# EAGLE board agatram128 (EAGLE 7.5.0), part 1 of 2
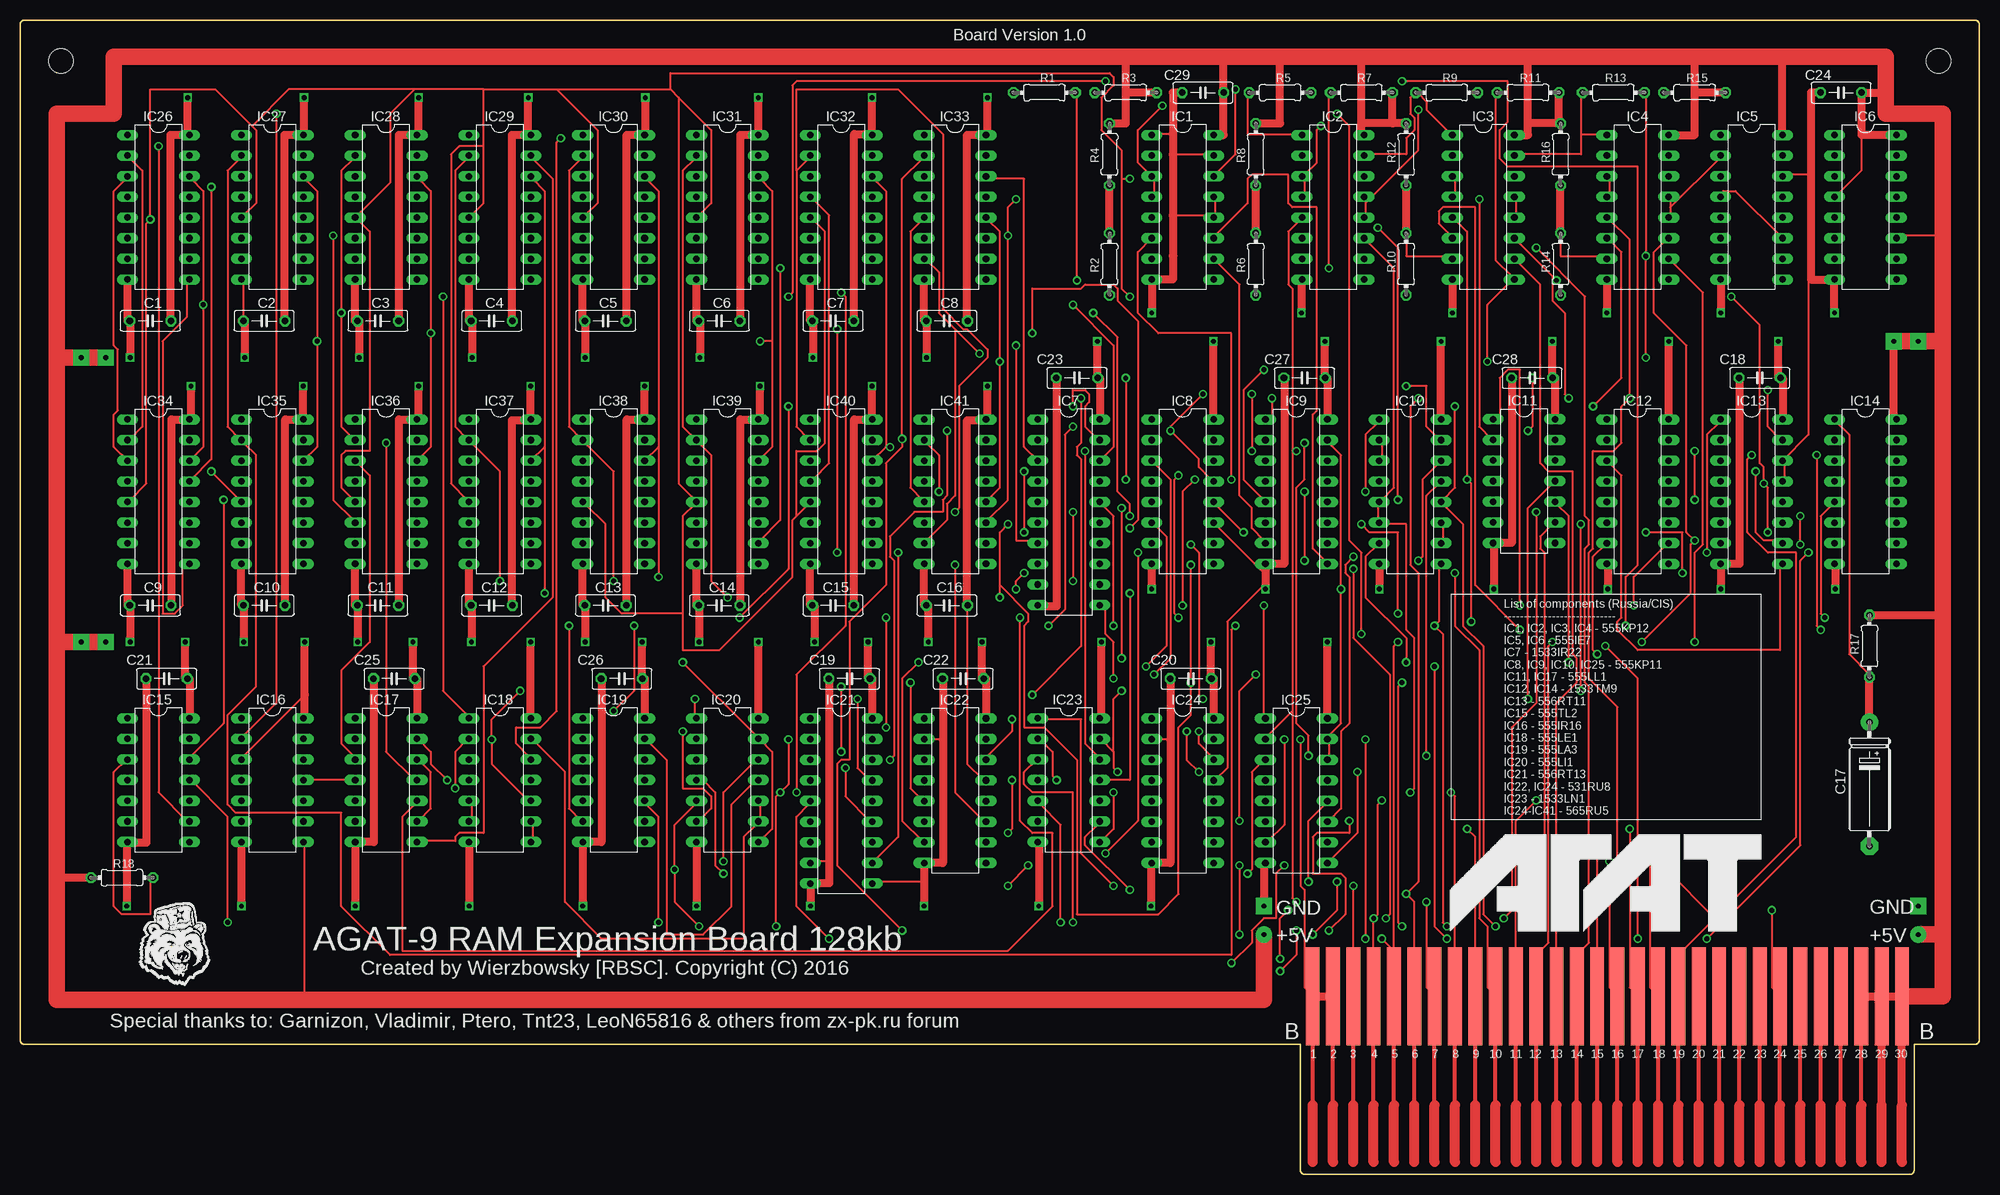
[diagram p3: board, top side]
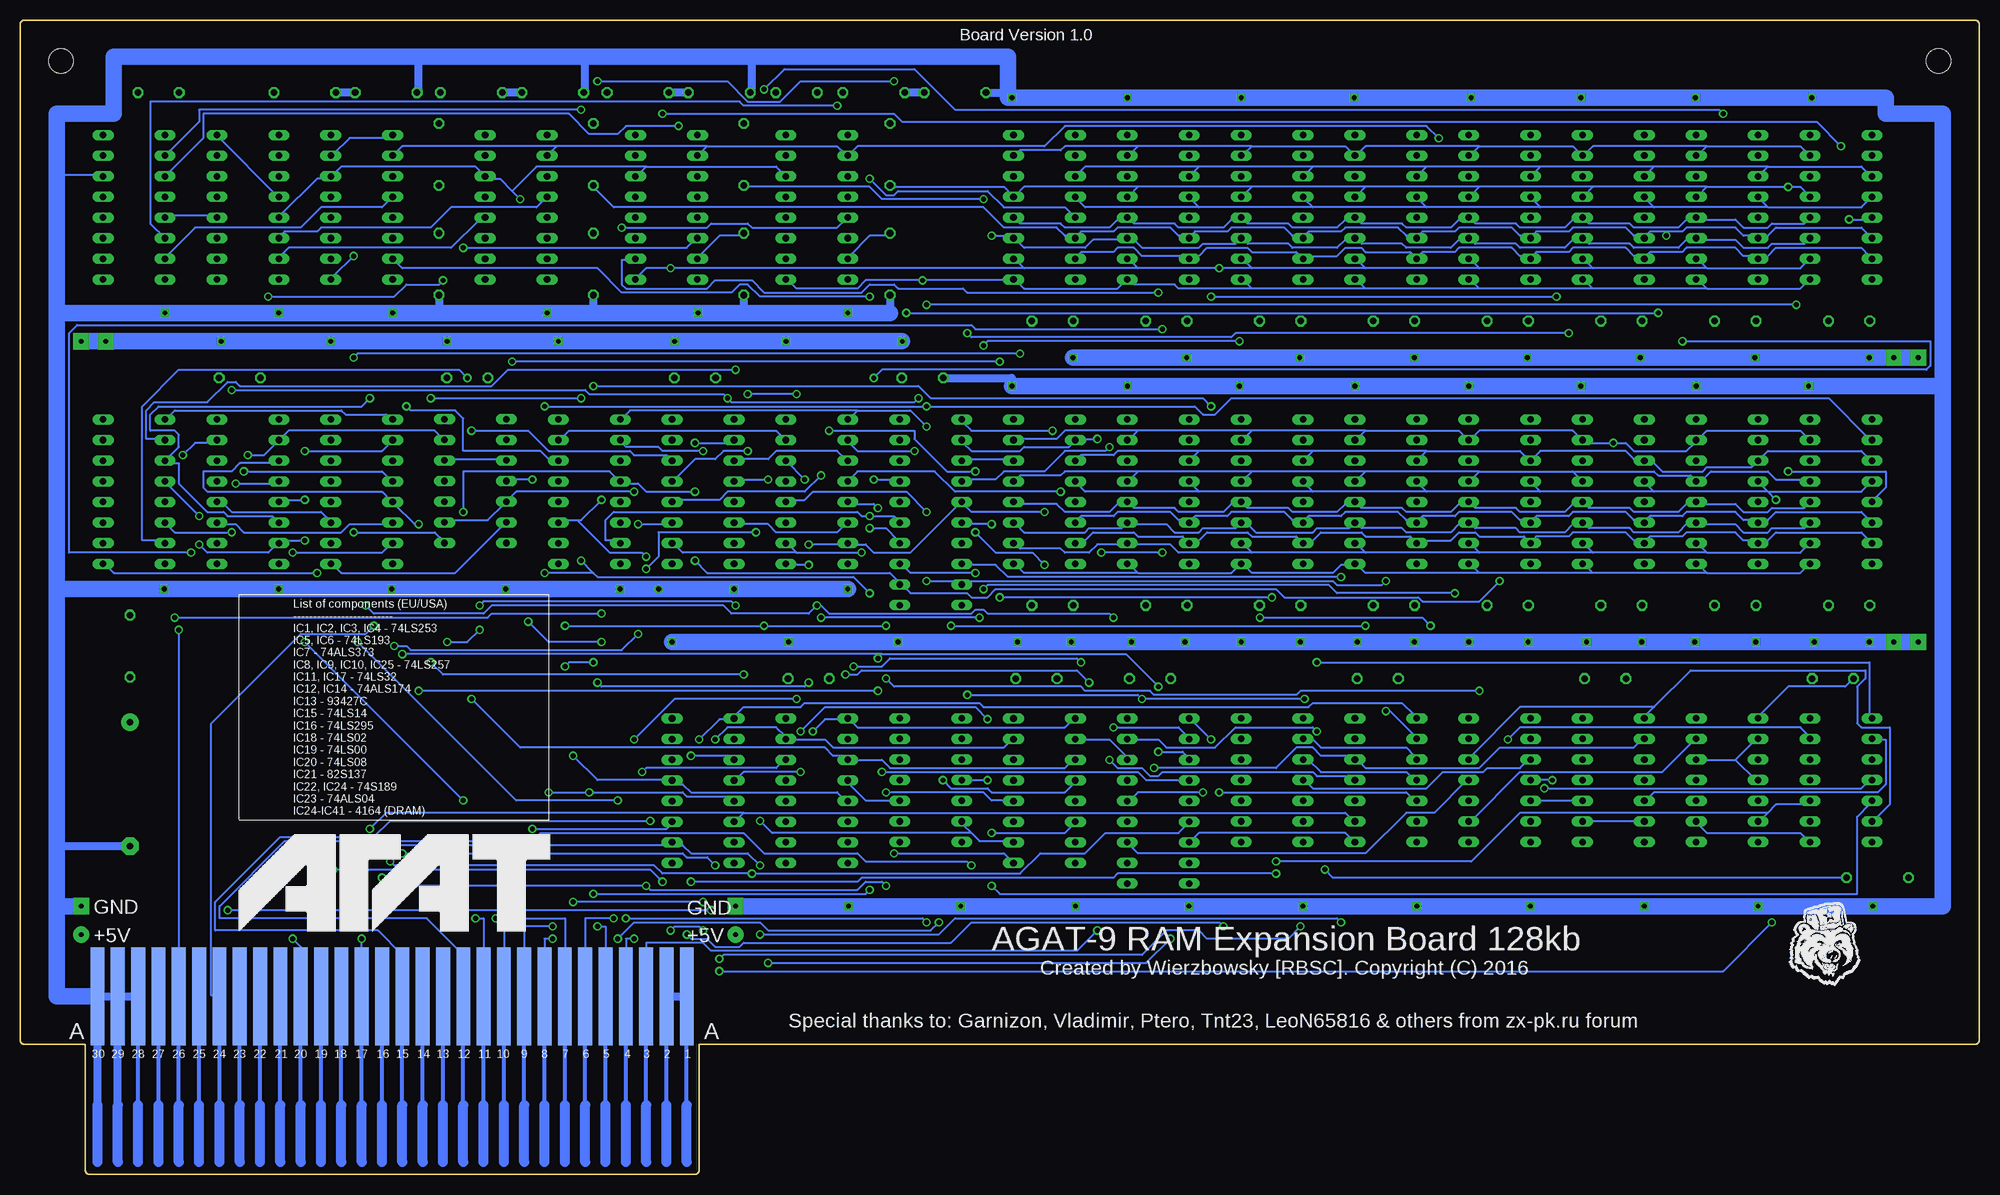
[diagram p4: board, bottom side, seen from below]

Size 241 x 142 mm. Coordinates in mm from the lower left corner, seen from the top.
Outline: 0.5,142 240.5,142 arc-90 241,141.5 241,16.5 arc-90 240.5,16 233,16 233,0.5 arc-90 232.5,0 158,0 arc-90 157.5,0.5 157.5,16 0.5,16 arc-90 0,16.5 0,141.5 arc-90 0.5,142
Copper layers (1*16): Top 0.035mm / dielectric 1.5mm / Bottom 0.035mm
Design rules "default *": minimum track width 10mil, minimum drill 24mil, track to track 8mil, track to pad 8mil, pad to pad 8mil, via to via 8mil, smd to smd 8mil, copper to edge 40mil, drill to drill 8mil, minimum pad ring 10mil, minimum via ring 8mil, stop-mask expansion 4mil, vias tented up to drill 24mil, thermal gap 10mil
Holes 3 mm at 5,137 236,137

## Footprints (pad centres in the part's own frame; a part is rotated, then mirrored left to right if it is on the bottom)
C050-025X075 = drill 0.813 octagon: 1 -2.54,0; 2 2.54,0
E15-5 = drill 0.813 pad 2.159: + -7.62,0 | drill 0.813 pad 2.159 octagon: - 7.62,0
AGAT_CONP = smd 1.7 x 12 bottom: A1 -75,21.9; A2 -72.5,21.9; A3 -70,21.9; A4 -67.5,21.9; A5 -65,21.9; A6 -62.5,21.9; A7 -60,21.9; A8 -57.5,21.9; A9 -55,21.9; A10 -52.5,21.9; A11 -50,21.9; A12 -47.5,21.9; A13 -45,21.9; A14 -42.5,21.9; A15 -40,21.9; A16 -37.5,21.9; A17 -35,21.9; A18 -32.5,21.9; A19 -30,21.9; A20 -27.5,21.9; A21 -25,21.9; A22 -22.5,21.9; A23 -20,21.9; A24 -17.5,21.9; A25 -15,21.9; A26 -12.5,21.9; A27 -10,21.9; A28 -7.5,21.9; A29 -5,21.9; A30 -2.5,21.9 | smd 1.7 x 12: B1 -75,21.9; B2 -72.5,21.9; B3 -70,21.9; B4 -67.5,21.9; B5 -65,21.9; B6 -62.5,21.9; B7 -60,21.9; B8 -57.5,21.9; B9 -55,21.9; B10 -52.5,21.9; B11 -50,21.9; B12 -47.5,21.9; B13 -45,21.9; B14 -42.5,21.9; B15 -40,21.9; B16 -37.5,21.9; B17 -35,21.9; B18 -32.5,21.9; B19 -30,21.9; B20 -27.5,21.9; B21 -25,21.9; B22 -22.5,21.9; B23 -20,21.9; B24 -17.5,21.9; B25 -15,21.9; B26 -12.5,21.9; B27 -10,21.9; B28 -7.5,21.9; B29 -5,21.9; B30 -2.5,21.9
DIL16 = drill 0.813 long: 1 -8.89,-3.81; 2 -6.35,-3.81; 3 -3.81,-3.81; 4 -1.27,-3.81; 5 1.27,-3.81; 6 3.81,-3.81; 7 6.35,-3.81; 8 8.89,-3.81; 9 8.89,3.81; 10 6.35,3.81; 11 3.81,3.81; 12 1.27,3.81; 13 -1.27,3.81; 14 -3.81,3.81; 15 -6.35,3.81; 16 -8.89,3.81
DIL20 = drill 0.813 long: 1 -8.89,-3.81; 2 -6.35,-3.81; 3 -3.81,-3.81; 4 -1.27,-3.81; 5 1.27,-3.81; 6 3.81,-3.81; 7 6.35,-3.81; 8 8.89,-3.81; 9 11.43,-3.81; 10 13.97,-3.81; 11 13.97,3.81; 12 11.43,3.81; 13 8.89,3.81; 14 6.35,3.81; 15 3.81,3.81; 16 1.27,3.81; 17 -1.27,3.81; 18 -3.81,3.81; 19 -6.35,3.81; 20 -8.89,3.81
DIL14 = drill 0.813 long: 1 -7.62,-3.81; 2 -5.08,-3.81; 3 -2.54,-3.81; 4 0,-3.81; 5 2.54,-3.81; 6 5.08,-3.81; 7 7.62,-3.81; 8 7.62,3.81; 9 5.08,3.81; 10 2.54,3.81; 11 0,3.81; 12 -2.54,3.81; 13 -5.08,3.81; 14 -7.62,3.81
DIL18 = drill 0.813 long: 1 -8.89,-3.81; 2 -6.35,-3.81; 3 -3.81,-3.81; 4 -1.27,-3.81; 5 1.27,-3.81; 6 3.81,-3.81; 7 6.35,-3.81; 8 8.89,-3.81; 9 11.43,-3.81; 10 11.43,3.81; 11 8.89,3.81; 12 6.35,3.81; 13 3.81,3.81; 14 1.27,3.81; 15 -1.27,3.81; 16 -3.81,3.81; 17 -6.35,3.81; 18 -8.89,3.81
0204/7 = drill 0.813 octagon: 1 -3.81,0; 2 3.81,0

## Placement (x,y rotation side)
C1  100nF  [C050-025X075]  16,105 180 top
C2  100nF  [C050-025X075]  30,105 180 top
C3  100nF  [C050-025X075]  44,105 180 top
C4  100nF  [C050-025X075]  58,105 180 top
C5  100nF  [C050-025X075]  72,105 180 top
C6  100nF  [C050-025X075]  86,105 180 top
C7  100nF  [C050-025X075]  100,105 180 top
C8  100nF  [C050-025X075]  114,105 180 top
C9  100nF  [C050-025X075]  16,70 180 top
C10  100nF  [C050-025X075]  30,70 180 top
C11  100nF  [C050-025X075]  44,70 180 top
C12  100nF  [C050-025X075]  58,70 180 top
C13  100nF  [C050-025X075]  72,70 180 top
C14  100nF  [C050-025X075]  86,70 180 top
C15  100nF  [C050-025X075]  100,70 180 top
C16  100nF  [C050-025X075]  114,70 180 top
C17  10uF 10v  [E15-5]  227.5,48 270 top
C18  100nF  [C050-025X075]  214,98 0 top
C19  100nF  [C050-025X075]  102,61 0 top
C20  100nF  [C050-025X075]  144,61 0 top
C21  100nF  [C050-025X075]  18,61 0 top
C22  100nF  [C050-025X075]  116,61 0 top
C23  100nF  [C050-025X075]  130,98 0 top
C24  100nF  [C050-025X075]  224,133.1 0 top
C25  100nF  [C050-025X075]  46,61 0 top
C26  100nF  [C050-025X075]  74,61 0 top
C27  100nF  [C050-025X075]  158,98 0 top
C28  100nF  [C050-025X075]  186,98 0 top
C29  100nF  [C050-025X075]  145.5,133.1 0 top
CN1  AGAT_SLOT  [AGAT_CONP]  234,0 0 top
IC1  74LS253N  [DIL16]  143,119 270 top
IC2  74LS253N  [DIL16]  161.5,119 270 top
IC3  74LS253N  [DIL16]  180,119 270 top
IC4  74LS253N  [DIL16]  199,119 270 top
IC5  74LS193N  [DIL16]  213,119 270 top
IC6  74LS193N  [DIL16]  227,119 270 top
IC7  74ALS373N  [DIL20]  129,84 270 top
IC8  74LS257N  [DIL16]  143,84 270 top
IC9  74LS257N  [DIL16]  157,84 270 top
IC10  74LS257N  [DIL16]  171,84 270 top
IC11  74LS32N  [DIL14]  185,85.3 270 top
IC12  74ALS174N  [DIL16]  199,84 270 top
IC13  93427C  [DIL16]  213,84 270 top
IC14  74ALS174N  [DIL16]  227,84 270 top
IC15  74LS14N  [DIL14]  17,48.5 270 top
IC16  74LS295N  [DIL14]  31,48.5 270 top
IC17  74LS32N  [DIL14]  45,48.5 270 top
IC18  74LS02N  [DIL14]  59,48.5 270 top
IC19  74LS00N  [DIL14]  73,48.5 270 top
IC20  74LS08N  [DIL14]  87,48.5 270 top
IC21  82S137  [DIL18]  101,47.2 270 top
IC22  74S189  [DIL16]  115,47.2 270 top
IC23  74ALS04N  [DIL14]  129,48.5 270 top
IC24  74S189  [DIL16]  143,47.2 270 top
IC25  74LS257N  [DIL16]  157,47.2 270 top
IC26  4164  [DIL16]  17,119 270 top
IC27  4164  [DIL16]  31,119 270 top
IC28  4164  [DIL16]  45,119 270 top
IC29  4164  [DIL16]  59,119 270 top
IC30  4164  [DIL16]  73,119 270 top
IC31  4164  [DIL16]  87,119 270 top
IC32  4164  [DIL16]  101,119 270 top
IC33  4164  [DIL16]  115,119 270 top
IC34  4164  [DIL16]  17,84 270 top
IC35  4164  [DIL16]  31,84 270 top
IC36  4164  [DIL16]  45,84 270 top
IC37  4164  [DIL16]  59,84 270 top
IC38  4164  [DIL16]  73,84 270 top
IC39  4164  [DIL16]  87,84 270 top
IC40  4164  [DIL16]  101,84 270 top
IC41  4164  [DIL16]  115,84 270 top
R1  1k  [0204/7]  126,133.1 0 top
R2  1k  [0204/7]  134,112 90 top
R3  1k  [0204/7]  136,133.1 0 top
R4  1k  [0204/7]  134,125.5 90 top
R5  1k  [0204/7]  155,133.1 0 top
R6  1k  [0204/7]  152,112 90 top
R7  1k  [0204/7]  165,133.1 0 top
R8  1k  [0204/7]  152,125.5 90 top
R9  1k  [0204/7]  175.5,133.1 0 top
R10  1k  [0204/7]  170.5,112 90 top
R11  1k  [0204/7]  185.5,133.1 0 top
R12  1k  [0204/7]  170.5,125.5 90 top
R13  1k  [0204/7]  196,133.1 0 top
R14  1k  [0204/7]  189.5,112 90 top
R15  1k  [0204/7]  206,133.1 0 top
R16  1k  [0204/7]  189.5,125.5 90 top
R17  3k3  [0204/7]  227.5,65 90 top
R18  2k7  [0204/7]  12.5,36.5 180 top